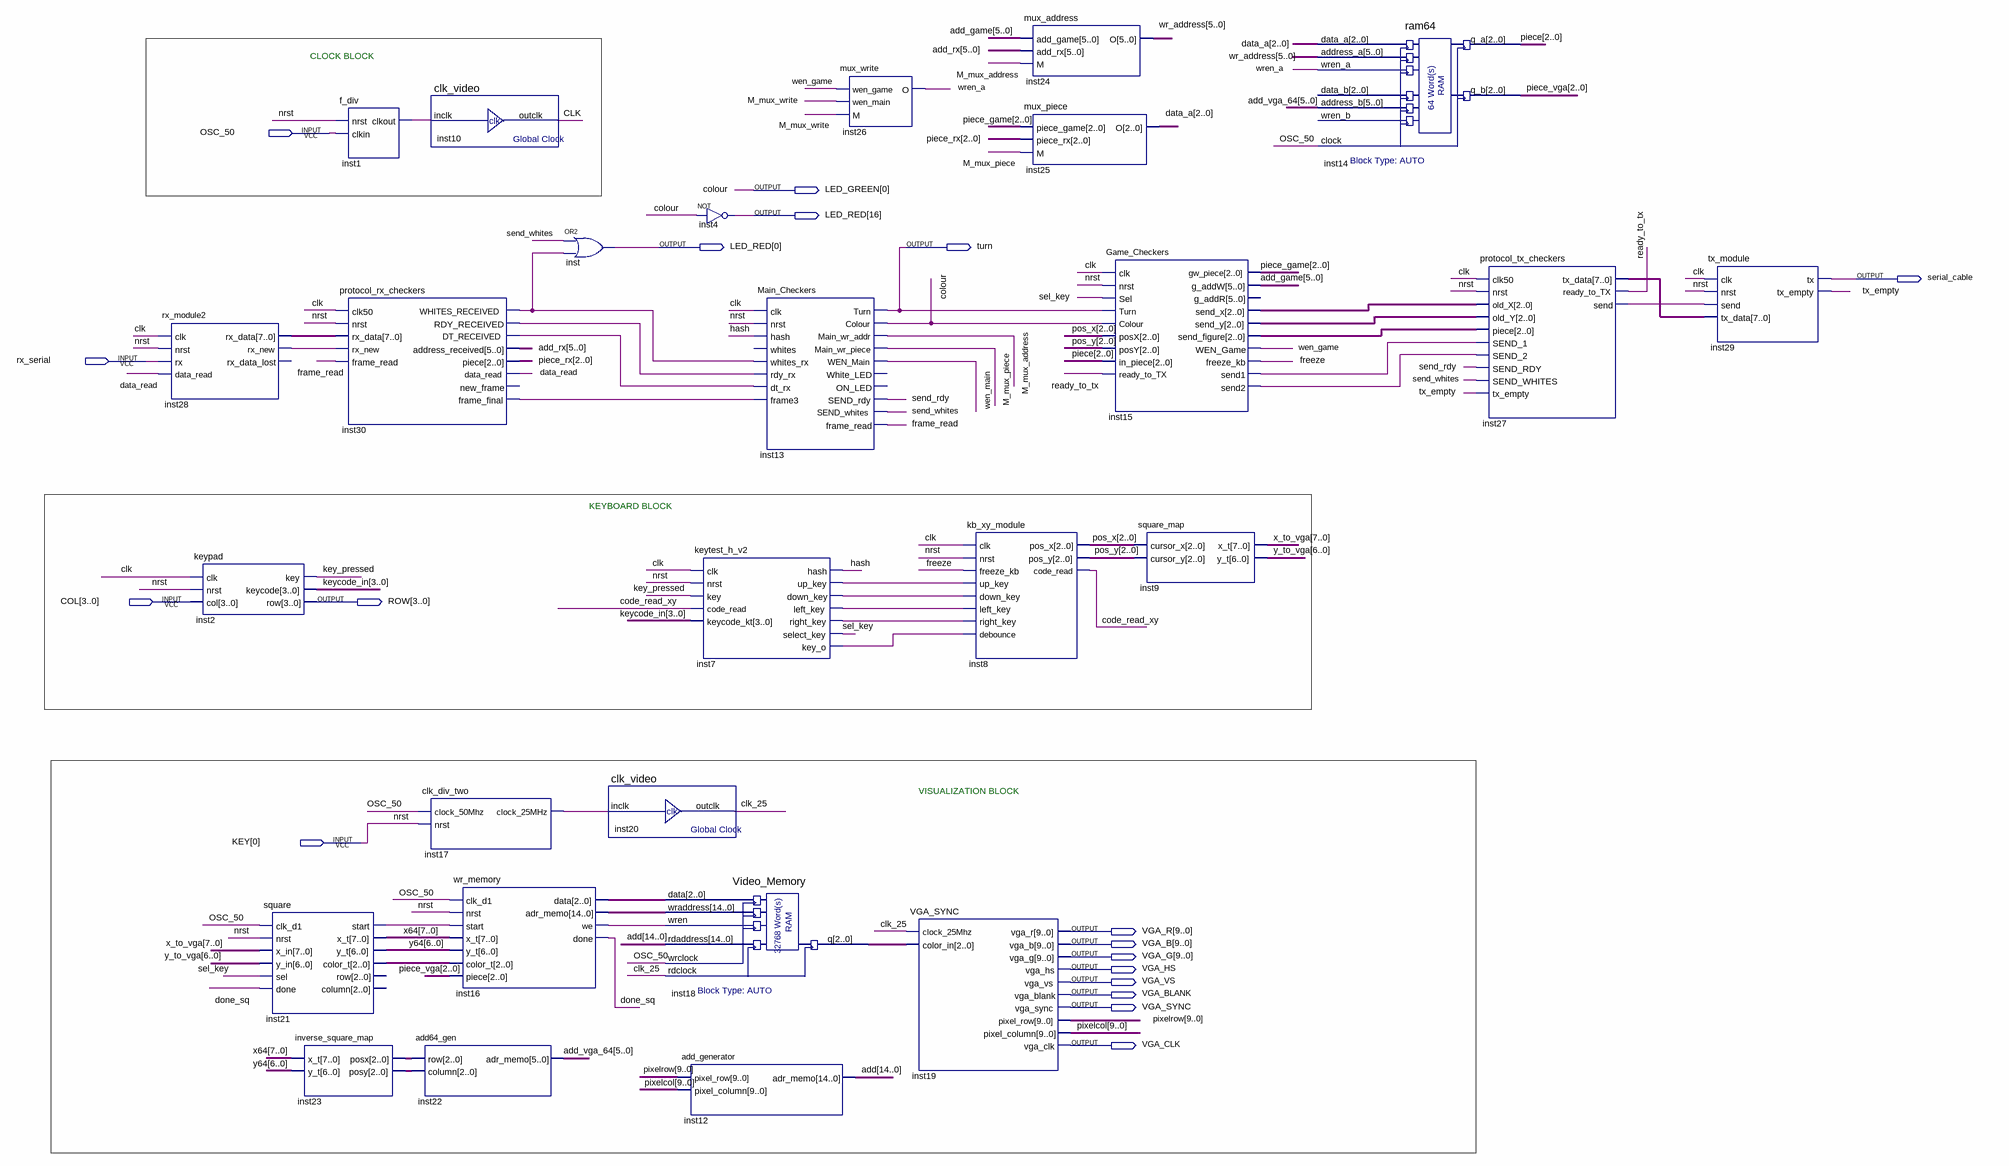
[diagram p0: schematic sheet]
// Quartus schematic sender_receiver.bdf as structural Verilog: 27 symbols, 18 pins
module sender_receiver (
  input  OSC_50,
  input  rx_serial,
  input  [3:0] COL,
  input  [0:0] KEY,
  output [0:0] LED_GREEN,
  output [16:0] LED_RED,
  output turn,
  output serial_cable,
  output [3:0] ROW,
  output [9:0] VGA_R,
  output [9:0] VGA_B,
  output [9:0] VGA_G,
  output VGA_HS,
  output VGA_VS,
  output VGA_BLANK,
  output VGA_SYNC,
  output VGA_CLK
);

  wire clk, clk_25, code_read_xy, data_read, done_sq, frame_read, freeze, hash, inst1_clkout, inst7_down_key,
       inst7_key_o, inst7_left_key, inst7_right_key, inst7_up_key, inst15_send1, inst15_send2, inst16_we,
       inst17_clock_25mhz, inst21_start, inst27_send, inst28_rx_new, inst30_dt_received, inst30_frame_final,
       inst30_rdy_received, inst30_whites_received, key_pressed, M_mux_address, M_mux_piece, M_mux_write,
       ready_to_tx, sel_key, send_rdy, send_whites, tx_empty, wen_game, wen_main, wren_a;
  wire [2:0] data_a, inst15_send_figure, inst15_send_x, inst15_send_y, inst16_data, inst18_q, inst21_color_t,
       inst23_posx, inst23_posy, piece, piece_game, piece_rx, piece_vga, pos_x, pos_y;
  wire [3:0] keycode_in;
  wire [5:0] add_game, add_rx, add_vga_64, wr_address;
  wire [6:0] y64, y_to_vga;
  wire [7:0] inst27_tx_data, inst28_rx_data, x64, x_to_vga;
  wire [9:0] pixelcol, pixelrow;
  wire [14:0] add, inst16_adr_memo;

  rx_module2 inst28 (
    .clk(clk), .nrst(KEY[0]), .rx(rx_serial), .data_read(data_read), .rx_data(inst28_rx_data),
    .rx_new(inst28_rx_new));  // open: rx_data_lost
  keypad inst2 (.clk(clk), .nrst(KEY[0]), .col(COL), .key(key_pressed), .keycode(keycode_in), .row(ROW));
  square inst21 (
    .clk_d1(OSC_50), .nrst(KEY[0]), .x_in(x_to_vga), .y_in(y_to_vga), .sel(sel_key), .done(done_sq),
    .start(inst21_start), .x_t(x64), .y_t(y64), .color_t(inst21_color_t));  // open: row, column
  inverse_square_map inst23 (.x_t(x64), .y_t(y64), .posx(inst23_posx), .posy(inst23_posy));
  f_div inst1 (.nrst(KEY[0]), .clkin(OSC_50), .clkout(inst1_clkout));
  protocol_rx_checkers inst30 (
    .clk50(clk), .nrst(KEY[0]), .rx_data(inst28_rx_data), .rx_new(inst28_rx_new), .frame_read(frame_read),
    .WHITES_RECEIVED(inst30_whites_received), .RDY_RECEIVED(inst30_rdy_received),
    .DT_RECEIVED(inst30_dt_received), .address_received(add_rx), .piece(piece_rx), .data_read(data_read),
    .frame_final(inst30_frame_final));  // open: new_frame
  clk_video inst10 (.inclk(inst1_clkout), .outclk(clk));
  clk_div_two inst17 (.clock_50Mhz(OSC_50), .nrst(KEY[0]), .clock_25MHz(inst17_clock_25mhz));
  add64_gen inst22 (.row(inst23_posx), .column(inst23_posy), .adr_memo(add_vga_64));
  wr_memory inst16 (
    .clk_d1(OSC_50), .nrst(KEY[0]), .start(inst21_start), .x_t(x64), .y_t(y64), .color_t(inst21_color_t),
    .piece(piece_vga), .data(inst16_data), .adr_memo(inst16_adr_memo), .we(inst16_we), .done(done_sq));
  or inst (LED_RED[0], send_whites, inst30_whites_received);
  clk_video inst20 (.inclk(inst17_clock_25mhz), .outclk(clk_25));
  not inst4 (LED_RED[16], LED_GREEN[0]);
  keytest_h_v2 inst7 (
    .clk(clk), .nrst(KEY[0]), .key(key_pressed), .code_read(code_read_xy), .keycode_kt(keycode_in),
    .hash(hash), .up_key(inst7_up_key), .down_key(inst7_down_key), .left_key(inst7_left_key),
    .right_key(inst7_right_key), .select_key(sel_key), .key_o(inst7_key_o));
  Video_Memory inst18 (
    .data(inst16_data), .wraddress(inst16_adr_memo), .wren(inst16_we), .rdaddress(add), .wrclock(OSC_50),
    .rdclock(clk_25), .q(inst18_q));
  add_generator inst12 (.pixel_row(pixelrow), .pixel_column(pixelcol), .adr_memo(add));
  Main_Checkers inst13 (
    .clk(clk), .nrst(KEY[0]), .hash(hash), .whites_rx(inst30_whites_received), .rdy_rx(inst30_rdy_received),
    .dt_rx(inst30_dt_received), .frame3(inst30_frame_final), .Turn(turn), .Colour(LED_GREEN[0]),
    .Main_wr_addr(M_mux_address), .Main_wr_piece(M_mux_piece), .WEN_Main(wen_main), .SEND_rdy(send_rdy),
    .SEND_whites(send_whites), .frame_read(frame_read));  // open: whites, White_LED, ON_LED
  mux_write inst26 (.wen_game(wen_game), .wen_main(M_mux_write), .M(M_mux_write), .O(wren_a));
  VGA_SYNC inst19 (
    .clock_25Mhz(clk_25), .color_in(inst18_q), .vga_r(VGA_R), .vga_b(VGA_B), .vga_g(VGA_G), .vga_hs(VGA_HS),
    .vga_vs(VGA_VS), .vga_blank(VGA_BLANK), .vga_sync(VGA_SYNC), .pixel_row(pixelrow),
    .pixel_column(pixelcol), .vga_clk(VGA_CLK));
  kb_xy_module inst8 (
    .clk(clk), .nrst(KEY[0]), .freeze_kb(freeze), .up_key(inst7_up_key), .down_key(inst7_down_key),
    .left_key(inst7_left_key), .right_key(inst7_right_key), .debounce(inst7_key_o), .pos_x(pos_x),
    .pos_y(pos_y), .code_read(code_read_xy));
  mux_address inst24 (.add_game(add_game), .add_rx(add_rx), .M(M_mux_address), .O(wr_address));
  mux_piece inst25 (.piece_game(piece_game), .piece_rx(piece_rx), .M(M_mux_piece), .O(data_a));
  Game_Checkers inst15 (
    .clk(clk), .nrst(KEY[0]), .Sel(sel_key), .Turn(turn), .Colour(LED_GREEN[0]), .posX(pos_x), .posY(pos_y),
    .in_piece(piece), .ready_to_TX(ready_to_tx), .gw_piece(piece_game), .g_addW(add_game),
    .send_x(inst15_send_x), .send_y(inst15_send_y), .send_figure(inst15_send_figure), .WEN_Game(wen_game),
    .freeze_kb(freeze), .send1(inst15_send1), .send2(inst15_send2));  // open: g_addR
  square_map inst9 (.cursor_x(pos_x), .cursor_y(pos_y), .x_t(x_to_vga), .y_t(y_to_vga));
  ram64 inst14 (
    .data_a(data_a), .address_a(wr_address), .wren_a(wren_a), .address_b(add_vga_64), .clock(OSC_50),
    .q_a(piece), .q_b(piece_vga));  // open: data_b, wren_b
  protocol_tx_checkers inst27 (
    .clk50(clk), .nrst(KEY[0]), .old_X(inst15_send_x), .old_Y(inst15_send_y), .piece(inst15_send_figure),
    .SEND_1(inst15_send1), .SEND_2(inst15_send2), .SEND_RDY(send_rdy), .SEND_WHITES(send_whites),
    .tx_empty(tx_empty), .tx_data(inst27_tx_data), .ready_to_TX(ready_to_tx), .send(inst27_send));
  tx_module inst29 (
    .clk(clk), .nrst(KEY[0]), .send(inst27_send), .tx_data(inst27_tx_data), .tx(serial_cable),
    .tx_empty(tx_empty));

  // Other names for the same wires on the sheet: colour = LED_GREEN[0]; nrst = KEY[0]

  // Notes on the sheet:
  //   CLOCK BLOCK
  //   KEYBOARD BLOCK
  //   VISUALIZATION BLOCK
endmodule
